# Altium schematic sheet ground.SchDoc
size A; SheetNumber: 3; SheetTotal: 6
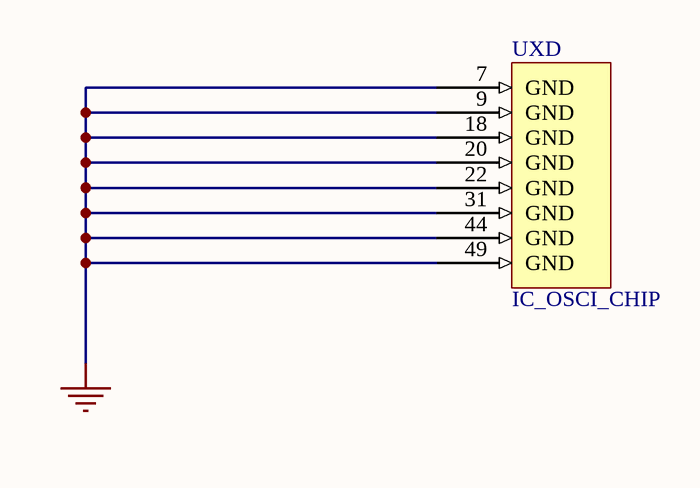
[diagram p0: ground.SchDoc]

## Parts
UX  IC_OSCI_CHIP  [QFN-48-.4-6.0X6.0-LP]  (part D of 4)

## Nets
GND: UX.7(GND) UX.9(GND) UX.18(GND) UX.20(GND) UX.22(GND) UX.31(GND) UX.44(GND) UX.49(GND)

## Library data of the parts
UX = IC_OSCI_CHIP: EE290C Tapeout Class IC